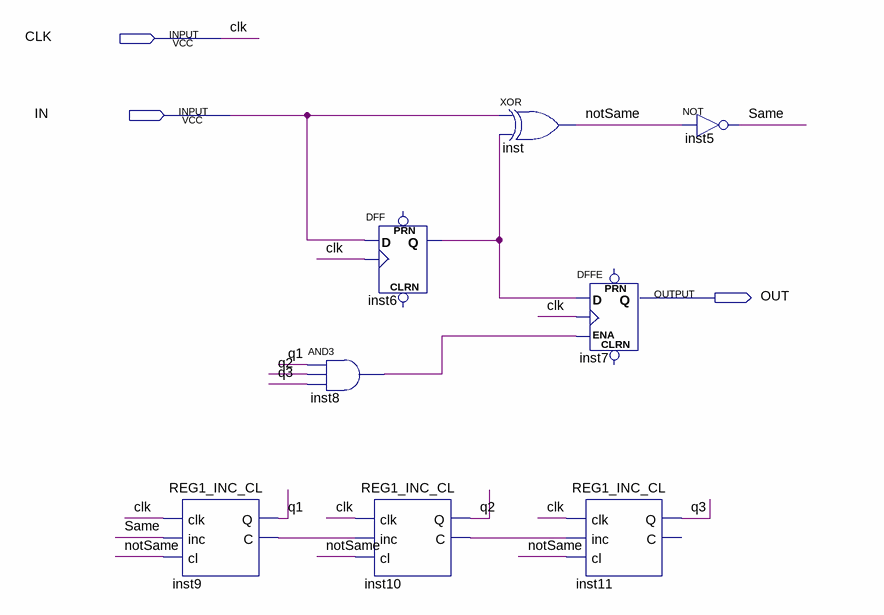
[diagram p0: schematic sheet]
// Quartus schematic Debouncer.bdf as structural Verilog: 8 symbols, 3 pins
module Debouncer (
  input  CLK,
  input  IN,
  output OUT
);

  wire inst6_q, inst8_out, inst9_c, inst10_c, notSame, q1, q2, q3, Same;

  REG1_INC_CL inst9 (.clk(CLK), .inc(Same), .cl(notSame), .Q(q1), .C(inst9_c));
  and inst8 (inst8_out, q1, q2, q3);
  REG1_INC_CL inst10 (.clk(CLK), .inc(inst9_c), .cl(notSame), .Q(q2), .C(inst10_c));
  DFF inst6 (.CLK(CLK), .D(IN), .Q(inst6_q));  // open: CLRN, PRN
  xor inst (notSame, IN, inst6_q);
  DFFE inst7 (.D(inst6_q), .CLK(CLK), .ENA(inst8_out), .Q(OUT));  // open: PRN, CLRN
  REG1_INC_CL inst11 (.clk(CLK), .inc(inst10_c), .cl(notSame), .Q(q3));  // open: C
  not inst5 (Same, notSame);
endmodule
